# EAGLE schematic shieldv2 (EAGLE 8.7.0)
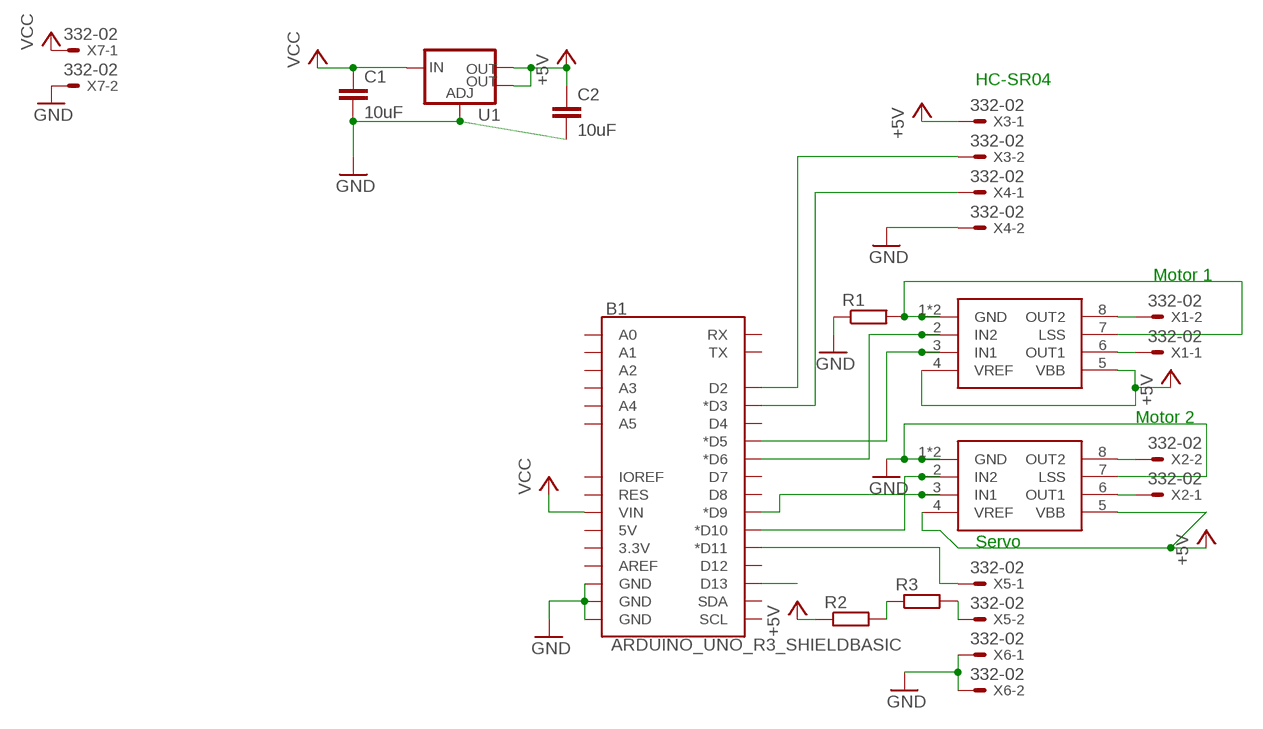
[diagram p0: schematic, sheet 1]

## Parts
B1  ARDUINO_UNO_R3_SHIELDBASIC  [UNO_R3_SHIELD]
C1  10uF  10UF-1206-6.3V-20%  [1206]
C2  10uF  10UF-1206-6.3V-20%  [1206]
R1  R-EU_M1206  [M1206]
R2  R-EU_M1206  [M1206]
R3  R-EU_M1206  [M1206]
U1  V_REG_LM1117SOT223  [SOT223]
U$1  A4953-H-BRIDGE-MOTOR-DRIVER-PAD  [SOIC8_PAD]
U$2  A4953-H-BRIDGE-MOTOR-DRIVER-PAD  [SOIC8_PAD]
X1  332-02  [332-02]
X2  332-02  [332-02]
X3  332-02  [332-02]
X4  332-02  [332-02]
X5  332-02  [332-02]
X6  332-02  [332-02]
X7  332-02  [332-02]

## Nets
+5V: C2.1 R2.1 U1.2(OUT) U1.4(OUT) U$1.4(VREF) U$1.5(VBB) U$2.4(VREF) U$2.5(VBB) X3.1
GND: B1.GND@0(GND) B1.GND@1(GND) B1.GND@2(GND) C1.2 C2.2 R1.1 U1.1(ADJ) U$2.1(GND) U$2.7(LSS) U$2.GND X4.2 X6.1 X6.2 X7.2
N$1: R1.2 U$1.1(GND) U$1.7(LSS) U$1.GND
N$2: B1.D6(*D6) U$1.2(IN2)
N$3: U$1.8(OUT2) X1.2
N$4: B1.D10(*D10) U$2.2(IN2)
N$5: U$1.6(OUT1) X1.1
N$6: U$2.8(OUT2) X2.2
N$7: U$2.6(OUT1) X2.1
N$8: B1.D5(*D5) U$1.3(IN1)
N$9: B1.D3(*D3) X4.1
N$10: B1.D2 X3.2
N$11: B1.D11(*D11) X5.1
N$12: B1.D13
N$13: B1.D9(*D9) U$2.3(IN1)
N$14: R3.2 X5.2
N$15: R2.2 R3.1
VCC: B1.VIN C1.1 U1.3(IN) X7.1
Unconnected: B1.3.3V B1.5V B1.A0 B1.A1 B1.A2 B1.A3 B1.A4 B1.A5 B1.AREF B1.D4 B1.D7 B1.D8 B1.D12 B1.IOREF B1.RES B1.RX B1.SCL B1.SDA B1.TX

## Notes on the sheet
- HC-SR04
- Motor 1
- Motor 2
- Servo

## Library data of the parts
B1 = SparkFun-Boards:ARDUINO_UNO_R3_SHIELD: Arduino R3 Shield Footprint Shield form compatible with the Arduino Uno R3. SparkFun Products: MG2639 Cellular Shield <https://www.sparkfun.com/products/13120> MIDI Shield <https://www.sparkfun.com/products/12898> R3 Stackable Headers Kit <https://www.sparkfun.com/products/11417>
C1 C2 = SparkFun-Capacitors:10UF: 10.0µF ceramic capacitors A capacitor is a passive two-terminal electrical component used to store electrical energy temporarily in an electric field.; PROD_ID: CAP-10057
R1-R3 = rcl:R-EU_: RESISTOR, European symbol; SPICEPREFIX: R
U1 = fab:V_REG_LM1117: Voltage Regulator LM1117 Standard adjustable voltage regulator but in SMD form. Spark Fun Electronics SKU : COM-00595; PROD_ID: VREG-08170
U$1 U$2 = fab:A4953-H-BRIDGE-MOTOR-DRIVER-PAD
X1-X7 = con-garry:332-02: 2 Pin - 2mm Dual Row Source: www.mpe-connector.de / garry_shortform_2012.pdf